# Altium schematic sheet Sheet1-control.SchDoc
size A3; SheetNumber: 2; SheetTotal: 5
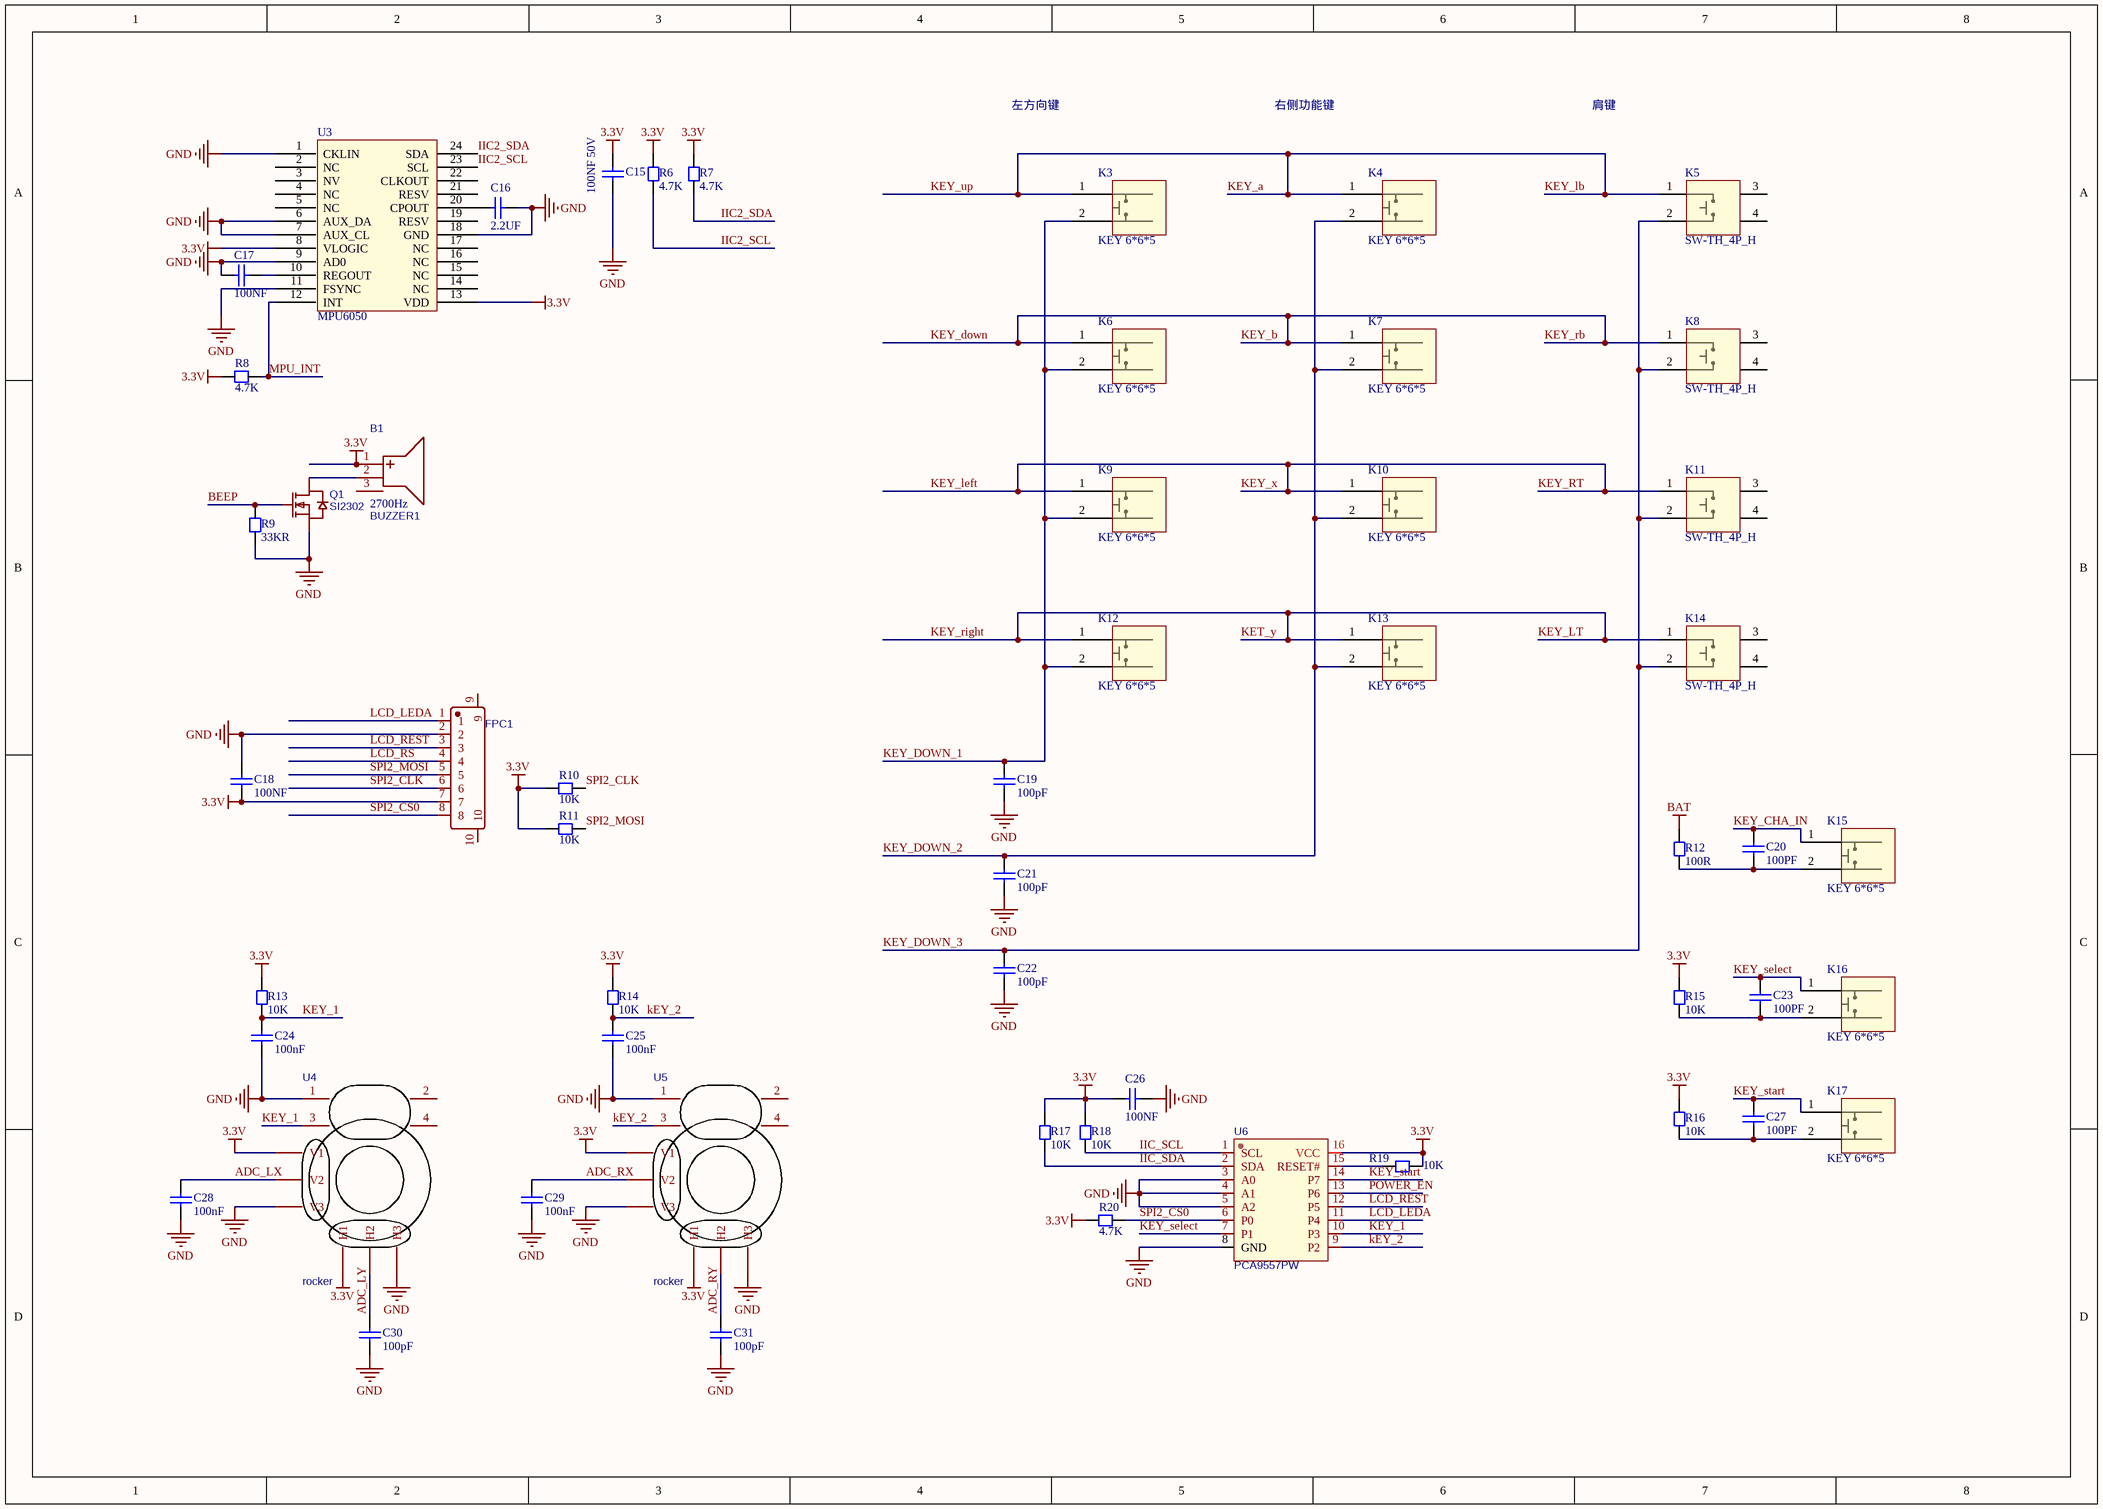
[diagram p0: Sheet1-control.SchDoc]

## Parts
B1  BUZZER1  [BUZ-SMD_GSC7525RA]
C15  100NF 50V  [CC1608-0603]
C16  2.2UF  [CC1608-0603]
C17  100NF  [CC1608-0603]
C18  100NF  [CC1608-0603]
C19  100pF  [CC1608-0603]
C20  100PF  [CC1608-0603]
C21  100pF  [CC1608-0603]
C22  100pF  [CC1608-0603]
C23  100PF  [CC1608-0603]
C24  100nF  [CC1608-0603]
C25  100nF  [CC1608-0603]
C26  100NF  [CC1608-0603]
C27  100PF  [CC1608-0603]
C28  100nF  [CC1608-0603]
C29  100nF  [CC1608-0603]
C30  100pF  [CC1608-0603]
C31  100pF  [CC1608-0603]
FPC1  FFC 05 8P  [FFC-SMD_8P-P0.50]  (value not drawn)
K3  KEY 6*6*5  [KEY 6*6*5]
K4  KEY 6*6*5  [KEY 6*6*5]
K5  SW-TH_4P_H  [SW-TH_KH-6X6X7H-ZJ]
K6  KEY 6*6*5  [KEY 6*6*5]
K7  KEY 6*6*5  [KEY 6*6*5]
K8  SW-TH_4P_H  [SW-TH_KH-6X6X7H-ZJ]
K9  KEY 6*6*5  [KEY 6*6*5]
K10  KEY 6*6*5  [KEY 6*6*5]
K11  SW-TH_4P_H  [SW-TH_KH-6X6X7H-ZJ]
K12  KEY 6*6*5  [KEY 6*6*5]
K13  KEY 6*6*5  [KEY 6*6*5]
K14  SW-TH_4P_H  [SW-TH_KH-6X6X7H-ZJ]
K15  KEY 6*6*5  [KEY 6*6*5]
K16  KEY 6*6*5  [KEY 6*6*5]
K17  KEY 6*6*5  [KEY 6*6*5]
Q1  SI2302  [SOT-23]
R6  4.7K  [CR1608-0603]
R7  4.7K  [CR1608-0603]
R8  4.7K  [CR1608-0603]
R9  33KR  [CR1608-0603]
R10  10K  [CR1608-0603]
R11  10K  [CR1608-0603]
R12  100R  [CR1608-0603]
R13  10K  [CR1608-0603]
R14  10K  [CR1608-0603]
R15  10K  [CR1608-0603]
R16  10K  [CR1608-0603]
R17  10K  [CR1608-0603]
R18  10K  [CR1608-0603]
R19  10K  [CR1608-0603]
R20  4.7K  [CR1608-0603]
U3  MPU6050  [QFN24 - duplicate]
U4  rocker  [PCBComponent_1]
U5  rocker  [PCBComponent_1]
U6  PCA9557PW  [TSSOP-16]

## Nets
3.3V: B1.1(+) C15.2 C18.1 C26.2 FPC1.7 R6.1 R7.1 R8.1 R10.2 R11.2 R13.2 R14.2 R15.1 R16.1 R17.1 R18.1 R19.1 R20.1 U3.8(VLOGIC) U3.13(VDD) U4.5(V1) U4.8(H1) U5.5(V1) U5.8(H1) U6.16(VCC)
BAT: R12.1
GND: C15.1 C16.2 C17.1 C18.2 C19.1 C21.1 C22.1 C24.1 C25.1 C26.1 C28.1 C29.1 C30.1 C31.1 FPC1.2 Q1.2(S) R9.2 U3.1(CKLIN) U3.6(AUX_DA) U3.7(AUX_CL) U3.9(AD0) U3.11(FSYNC) U3.18(GND) U4.1 U4.7(V3) U4.10(H3) U5.1 U5.7(V3) U5.10(H3) U6.3(A0) U6.4(A1) U6.5(A2) U6.8(GND)
ADC_LX: C28.2 U4.6(V2)
ADC_LY: C30.2 U4.9(H2)
ADC_RX: C29.2 U5.6(V2)
ADC_RY: C31.2 U5.9(H2)
BEEP: Q1.1(G) R9.1
IIC2_SCL: R6.2 U3.23(SCL)
IIC2_SDA: R7.2 U3.24(SDA)
IIC_SCL: R18.2 U6.1(SCL)
IIC_SDA: R17.2 U6.2(SDA)
KET_y: K12.1 K13.1 K14.1  [also labelled KEY_LT, KEY_right]
KEY_1: C24.2 R13.1 U4.3 U6.10(P3)
kEY_2: C25.2 R14.1 U5.3 U6.9(P2)
KEY_a: K3.1 K4.1 K5.1  [also labelled KEY_lb, KEY_up]
KEY_b: K6.1 K7.1 K8.1  [also labelled KEY_down, KEY_rb]
KEY_CHA_IN: C20.1 K15.1
KEY_DOWN_1: C19.2 K3.2 K6.2 K9.2 K12.2
KEY_DOWN_2: C21.2 K4.2 K7.2 K10.2 K13.2
KEY_DOWN_3: C22.2 K5.2 K8.2 K11.2 K14.2
KEY_left: K9.1 K10.1 K11.1  [also labelled KEY_RT, KEY_x]
KEY_select: C23.1 K16.1 U6.7(P1)
KEY_start: C27.1 K17.1 U6.14(P7)
LCD_LEDA: FPC1.1 U6.11(P4)
LCD_REST: FPC1.3 U6.12(P5)
LCD_RS: FPC1.4
MPU_INT: R8.2 U3.12(INT)
POWER_EN: U6.13(P6)
SPI2_CLK: FPC1.6 R10.1
SPI2_CS0: FPC1.8 R20.2 U6.6(P0)
SPI2_MOSI: FPC1.5 R11.1
NetB1_2: B1.2(-) Q1.3(D)
NetC16_1: C16.1 U3.20(CPOUT)
NetC17_2: C17.2 U3.10(REGOUT)
NetC20_2: C20.2 K15.2 R12.2
NetC23_2: C23.2 K16.2 R15.2
NetC27_2: C27.2 K17.2 R16.2
NetR19_2: R19.2 U6.15(RESET#)

Not connected (* = marked no-connect by the designer): B1 3(EH); FPC1 9 10; K5 3 4; K8 3 4; K11 3 4; K14 3 4; U3 2(NC) 3(NV) 4(NC) 5(NC) 14(NC) 15(NC) 16(NC) 17(NC) 19(RESV) 21(RESV) 22(CLKOUT); U4 2 4; U5 2 4

## Notes on the sheet
- 左方向键
- 右侧功能键
- 肩键

## Library data of the parts
B1 = BUZZER1: 2700Hz; Manufacturer: INGHAi(赢海); Manufacturer Part: GSC7525RA-16R2700; Contributor: LCSC; nameAlias: Value; Supplier: LCSC; Supplier Part: C255313; spicePre: B; spiceSymbolName: GSC7525RA-16R2700
C15-C31 = Cap Chip 0603: 0603封装的电容; Published: 8-Jun-2000; Revision: July-2002: Re-released for DXP Platform.; Publisher: Altium Limited
FPC1 = FFC 05 8P: Manufacturer: TXGA(特思嘉); Manufacturer Part: FFC05001-08SBB124W5M-H; Contributor: LCSC; Supplier: LCSC; Supplier Part: C456420; JLCPCB Part Class: Extended Part; spicePre: F; spiceSymbolName: FFC05001-08SBB124W5M-H
K3 K4 K6 K7 K9 K10 K12 K13 K15-K17 = KEY 6*6*5: 无声轻触开关
K5 K8 K11 K14 = SW-TH_4P_H: 卧式轻触开关
Q1 = SI2302: N沟道 / 漏源电压(Vdss) 20V / 连续漏极电流(Id) 2.8A / 功率(Pd) 900mW / 导通电阻(RDS(on)@Vgs,Id) 55mΩ@4.5V,2.8A / 阈值电压(Vgs(th)@Id) 1.2V@250uA / 输入电容(Ciss@Vds) 260pF@10V; Manufacturer: TWGMC(台湾迪嘉); Manufacturer Part: SI2306; Contributor: LCSC; Supplier: LCSC; Supplier Part: C727154; JLCPCB Part Class: Extended Part; spicePre: Q; spiceSymbolName: SI2306_C727154
R6-R8 R10-R20 = Resistor Chip 0603: 0603封装电阻; Published: 8-Jun-2000; Revision: July-2002: Re-released for DXP Platform.; Publisher: Altium Limited
R9 = Chip resistor: 贴片电阻
U3 = MPU6050: 陀螺仪
U4 U5 = rocker: Manufacturer Part: 摇杆; Contributor: Alex_Ai; spicePre: U; spiceSymbolName: 摇杆_直插_圆半径13_10电气脚_4固定脚 COPY
U6 = PCA9557PW: TSSOP-16 8位I2C总线和SMBus I/O扩展器芯片; Manufacturer: TI(德州仪器); Contributor: LCSC; Supplier: LCSC; Supplier Part: C1542488; Manufacturer Part: PCA9557PW; JLCPCB Part Class: Extended Part; spicePre: U; spiceSymbolName: PCA9557PW